# EAGLE design ECG (EAGLE 8.2.1)
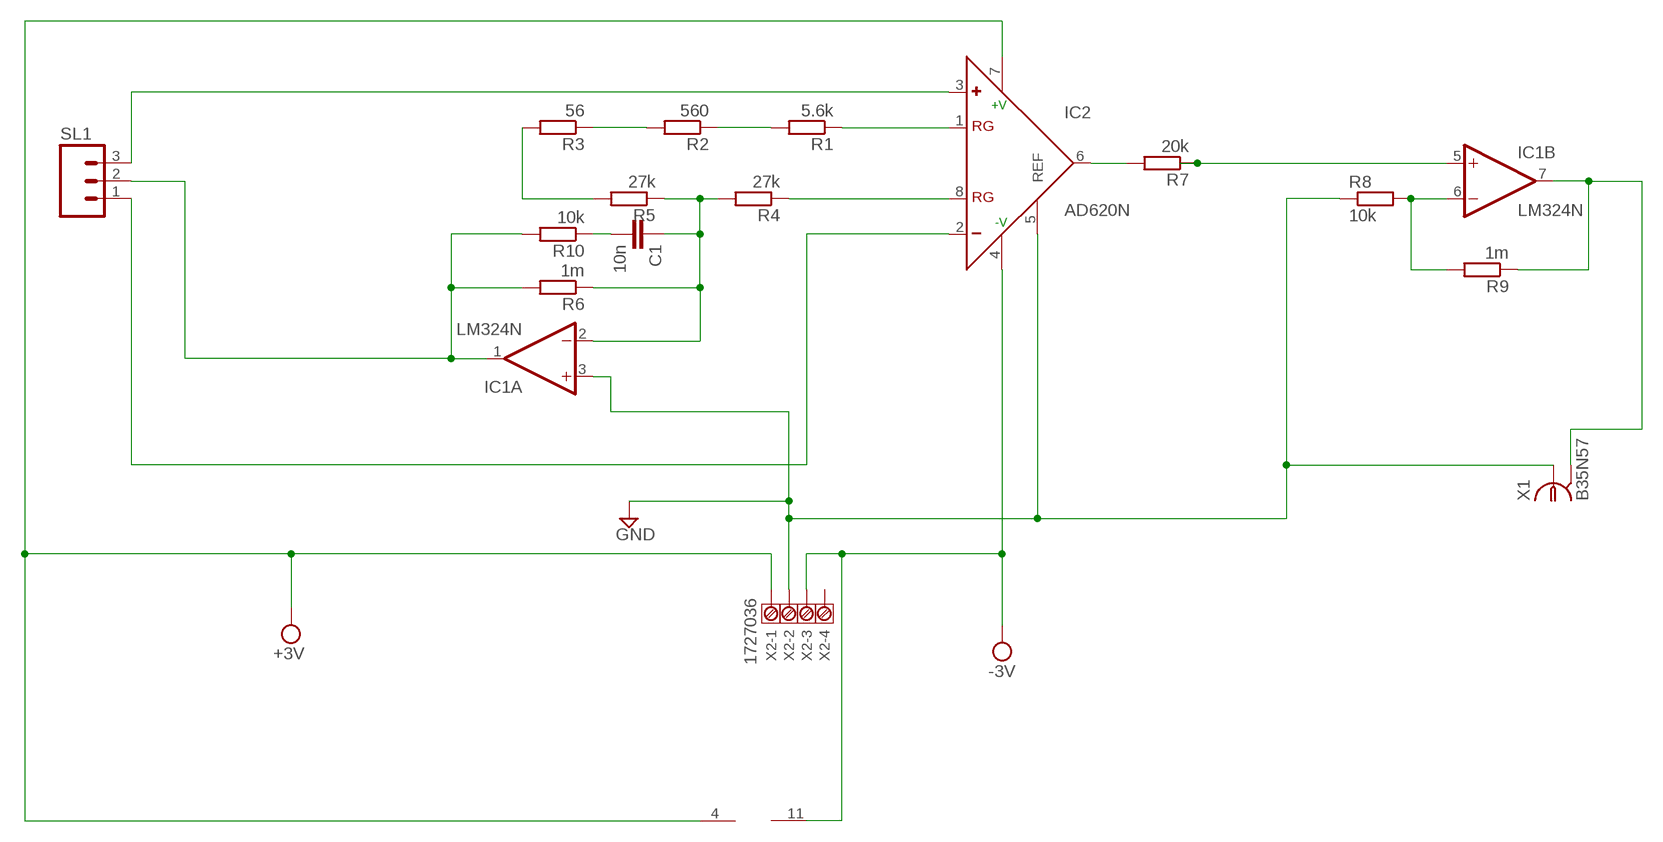
[diagram p0: schematic, sheet 1]

## Parts
C1  10n  C-EU025-024X044  [C025-024X044]
IC1  LM324N  [DIL14]
IC2  AD620N  [DIL08]
R1  5.6k  R-EU_0204/7  [0204/7]
R2  560  R-EU_0204/7  [0204/7]
R3  56  R-EU_0204/7  [0204/7]
R4  27k  R-EU_0204/7  [0204/7]
R5  27k  R-EU_0204/7  [0204/7]
R6  1m  R-EU_0204/7  [0204/7]
R7  20k  R-EU_0204/7  [0204/7]
R8  10k  R-EU_0204/7  [0204/7]
R9  1m  R-EU_0204/7  [0204/7]
R10  10k  R-EU_0204/7  [0204/7]
SL1  MA03  [03P]
X1  B35N57  [B35N57]
X2  1727036  [1727036]

## Nets
GND: IC1.3(A:+IN) IC2.5(REF) R8.1 X1.1 X2.2
N$1: IC1.5(B:+IN) R7.1
N$2: R1.2 R2.1
N$3: IC2.8(RG) R4.1
N$4: IC2.1(RG) R1.1
N$5: IC2.6(OUT) R7.2
N$6: IC1.1(A:OUT) R6.2 R10.2 SL1.2
N$7: R2.2 R3.1
N$8: R3.2 R5.2
N$10: IC2.2(-) SL1.1
N$11: IC2.3(+) SL1.3
N$13: C1.2 R10.1
N$14: C1.1 IC1.2(A:-IN) R4.2 R5.1 R6.1
N$16: IC1.6(B:-IN) R8.2 R9.2
N$17: IC1.7(B:OUT) R9.1 X1.2 X1.3 X1.4 X1.5
VCC: IC1.4(P:V+) IC2.7(+V) X2.1 ; supply symbol labelled +3V
VEE: IC1.11(P:V-) IC2.4(-V) X2.3 ; supply symbol labelled -3V
Unconnected: IC1.8(C:OUT) IC1.9(C:-IN) IC1.10(C:+IN) IC1.12(D:+IN) IC1.13(D:-IN) IC1.14(D:OUT) X2.4

## Library data of the parts
C1 = rcl:C-EU: CAPACITOR, European symbol
IC1 = linear:LM324: OP AMP
IC2 = analog-devices:AD620: Low Cost, Low Power, Instrumentation Amplifier Source: http://www.analog.com/UploadedFiles/Data_Sheets/37793330023930AD620_e.pdf; MF: ALTERA CORPORATION; MPN: AD620AN; OC_FARNELL: 1523782; OC_NEWARK: 05F7108
R1-R10 = rcl:R-EU_: RESISTOR, European symbol
SL1 = con-amp-quick:MA03: AMP QUICK CONNECTOR; OC_FARNELL: unknown; OC_NEWARK: unknown
X1 = con-coax:B35N57: BNC CONNECTOR M/A COM www.macom.com; OC_FARNELL: unknown; OC_NEWARK: unknown
X2 = con-phoenix-3.81:1727036: MKDS 1/4-3,81 Source: http://eshop.phoenixcontact.de; MF: FARNELL; MPN: 1727036; OC_FARNELL: 3704592; OC_NEWARK: 71C4114

## Board
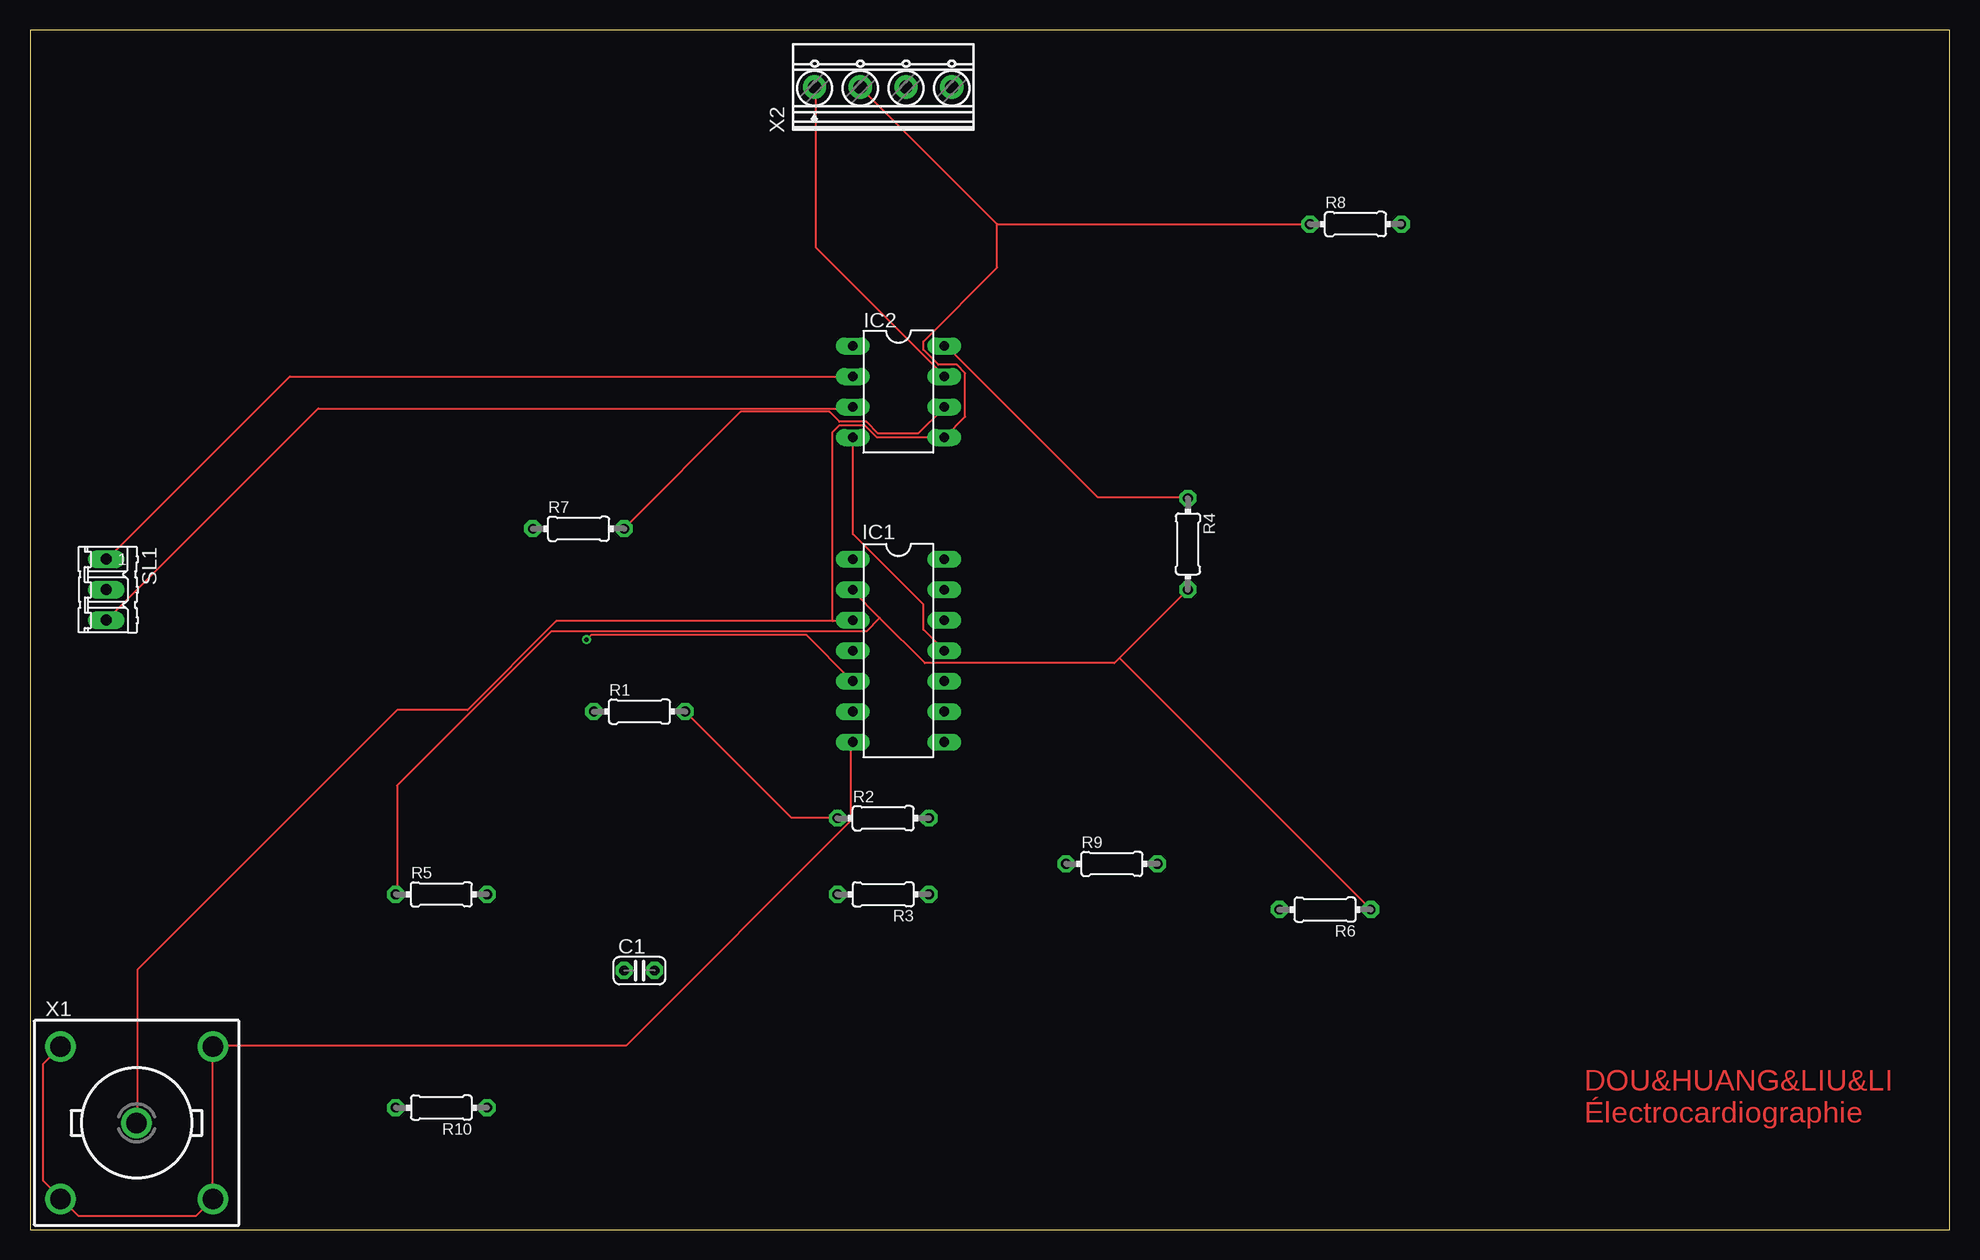
[diagram p1: board, top side]
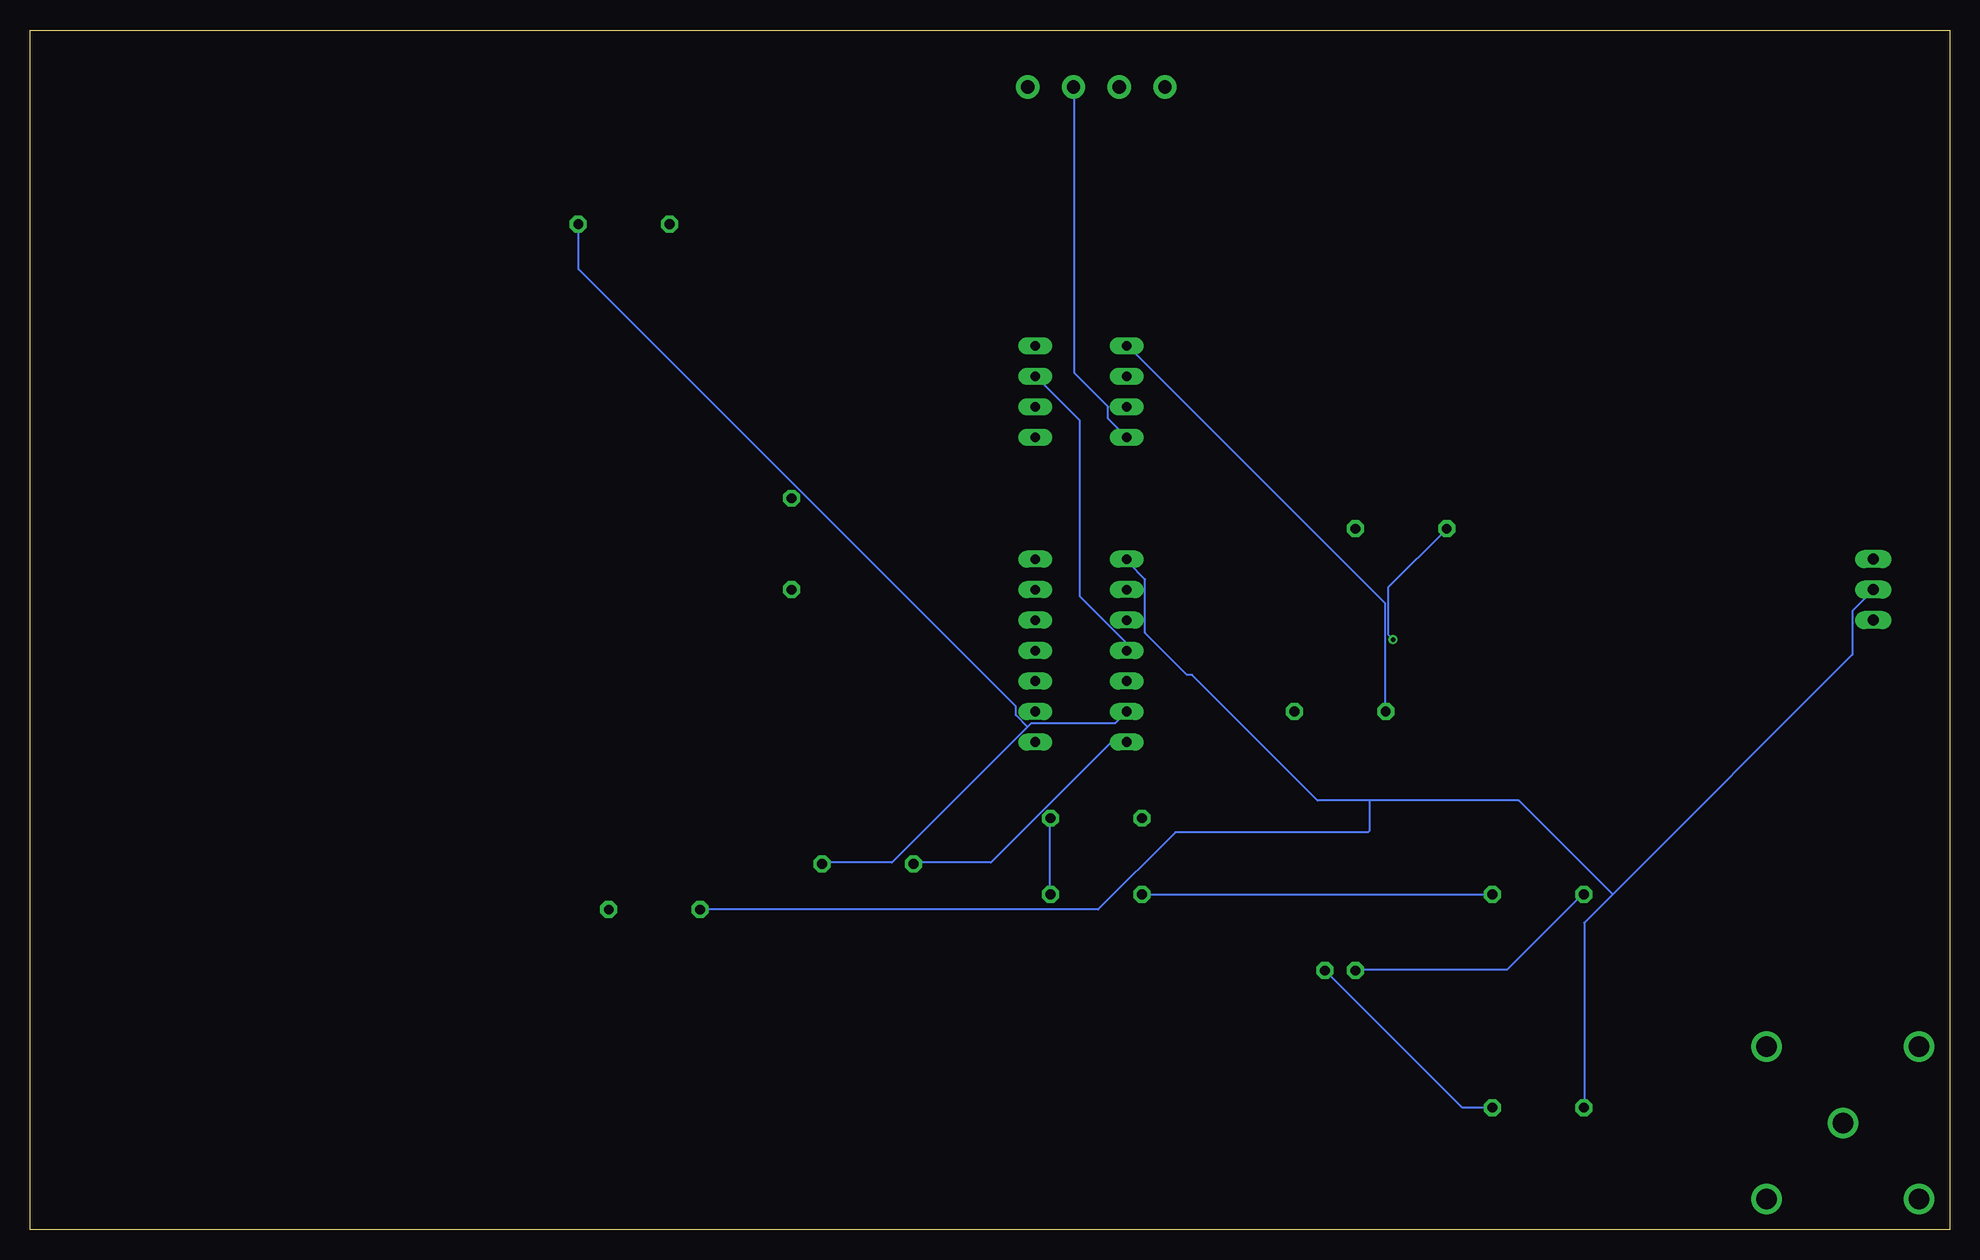
[diagram p2: board, bottom side, seen from below]

Size 160 x 100 mm. Coordinates in mm from the lower left corner, seen from the top.
Outline: 0,0 160,0 160,100 0,100 0,0
Copper layers (1*16): Top 0.035mm / dielectric 1.5mm / Bottom 0.035mm
Design rules "default": minimum track width 6mil, minimum drill 0.35mm, track to track 5mil, track to pad 5mil, pad to pad 5mil, via to via 5mil, smd to smd 5mil, copper to edge 40mil, drill to drill 6mil, minimum pad ring 0.3mm, minimum via ring 8mil, stop-mask expansion 4mil, vias tented up to drill 0mil, thermal gap 10mil

### Footprints (pad centres in the part's own frame; a part is rotated, then mirrored left to right if it is on the bottom)
C025-024X044 = drill 0.813 octagon: 1 -1.27,0; 2 1.27,0
DIL14 = drill 0.813 long: 1 -7.62,-3.81; 2 -5.08,-3.81; 3 -2.54,-3.81; 4 0,-3.81; 5 2.54,-3.81; 6 5.08,-3.81; 7 7.62,-3.81; 8 7.62,3.81; 9 5.08,3.81; 10 2.54,3.81; 11 0,3.81; 12 -2.54,3.81; 13 -5.08,3.81; 14 -7.62,3.81
DIL08 = drill 0.813 long: 1 -3.81,-3.81; 2 -1.27,-3.81; 3 1.27,-3.81; 4 3.81,-3.81; 5 3.81,3.81; 6 1.27,3.81; 7 -1.27,3.81; 8 -3.81,3.81
0204/7 = drill 0.813 octagon: 1 -3.81,0; 2 3.81,0
03P = drill 0.914 long: 1 -2.54,0; 2 0,0; 3 2.54,0
B35N57 = drill 1.7: 1 0,0; 2 6.35,6.35; 3 -6.35,6.35; 4 -6.35,-6.35; 5 6.35,-6.35
1727036 = drill 1.1 pad 1.93: 1 -5.715,0; 2 -1.905,0; 3 1.905,0; 4 5.715,0

### Placement (x,y rotation side)
C1  50.8,21.59 0 top
IC1  72.39,48.26 270 top
IC2  72.39,69.85 270 top
R1  50.8,43.18 0 top
R2  71.12,34.29 0 top
R3  71.12,27.94 180 top
R4  96.52,57.15 270 top
R5  34.29,27.94 0 top
R6  107.95,26.67 180 top
R7  45.72,58.42 0 top
R8  110.49,83.82 0 top
R9  90.17,30.48 0 top
R10  34.29,10.16 180 top
SL1  6.35,53.34 270 top
X1  8.89,8.89 0 top
X2  71.12,95.25 0 top

### Tracks (layer width: path | path; a pad name or v marks a point on that pad's centre or on a via)
GND
  Top 0.152: 80.61,83.82 R8.1 | 80.61,83.82 69.29,95.14 X2.2 | 66.92,50.71 68.45,50.71 IC1.3 | 66.92,50.71 43.87,50.71 36.46,43.31 30.59,43.31 8.94,21.65 8.94,8.94 X1.1 | 66.92,50.71 66.92,66.5 67.47,67.06 69.57,67.06 70.55,66.08 76.14,66.08 IC2.5 76.28,66.08 77.95,67.75 77.95,71.39 77.25,72.08 75.72,72.08 74.46,73.34 74.46,74.04 80.61,80.19 80.61,83.82
N$1  (via drill 0.35)
  Top 0.152: v46.38,49.17 46.8,49.59 64.68,49.59 68.45,45.82 IC1.5
  Bottom 0.152: v46.38,49.17 46.8,49.59 46.8,53.51 41.91,58.4 R7.1
N$2
  Top 0.152: R1.2 63.42,34.37 67.2,34.37 R2.1
N$3
  Top 0.152: R4.1 96.39,61.05 88.99,61.05 76.28,73.76 IC2.8
N$4
  Bottom 0.152: R1.1 47.08,43.31 47.08,52.25 68.45,73.62 IC2.1
N$5
  Top 0.152: R7.2 49.59,58.53 59.23,68.17 66.64,68.17 67.47,67.33 69.71,67.33 70.69,66.36 74.04,66.36 76.14,68.45 IC2.6
N$6
  Bottom 0.152: 28.08,27.94 8.1,47.92 8.1,51.55 6.43,53.23 SL1.2 | 28.08,27.94 30.45,25.57 30.45,10.2 R10.2 | 48.34,35.76 35.9,35.76 28.08,27.94 | 48.34,35.76 52.67,35.76 63.14,46.24 63.56,46.24 67.06,49.73 67.06,54.2 68.45,55.6 68.45,55.88 IC1.1 | 48.34,35.76 48.34,33.25 48.48,33.11 64.54,33.11 70.97,26.68 104.08,26.68 R6.2
N$7
  Bottom 0.152: R3.1 75.02,27.94 75.02,34.23 R2.2
N$8
  Bottom 0.152: R3.2 R5.2
N$10
  Top 0.152: IC2.2 68.45,71.11 21.65,71.11 6.43,55.88 SL1.1
N$11
  Top 0.152: IC2.3 68.45,68.45 24.03,68.45 6.43,50.85 SL1.3
N$13
  Bottom 0.152: R10.1 38.14,10.2 40.65,10.2 51.97,21.51 C1.2
N$14
  Top 0.152: 70.83,50.99 74.6,47.22 90.39,47.22 90.81,47.64 | 70.83,50.99 68.59,53.23 IC1.2 | 90.81,47.64 96.39,53.23 R4.2 | 90.81,47.64 111.76,26.68 R6.1 | 70.83,50.99 69.71,49.87 43.45,49.87 30.59,37.02 30.59,27.94 R5.1
  Bottom 0.152: C1.1 49.45,21.65 36.88,21.65 30.59,27.94 R5.1
N$16
  Bottom 0.152: 76.83,41.91 76.56,42.19 69.57,42.19 IC1.6 | 76.83,41.91 88.15,30.59 93.88,30.59 R9.2 | 76.83,41.91 77.81,42.89 77.81,43.59 114.28,80.05 114.28,83.82 R8.2
N$17
  Top 0.152: X1.3 2.52,15.23 1.12,13.83 1.12,4.05 2.52,2.65 X1.4 2.65,2.52 4.05,1.12 13.83,1.12 15.23,2.52 X1.5 15.23,2.65 15.23,15.23 X1.2 15.37,15.37 49.73,15.37 68.45,34.09 68.45,40.51 IC1.7
  Bottom 0.152: R9.1 86.33,30.59 79.91,30.59 69.99,40.51 68.59,40.51 IC1.7
VCC
  Top 0.152: X2.1 65.52,95.14 65.52,81.86 76.14,71.25 IC2.7
  Bottom 0.152: IC1.4 68.59,48.34 68.59,48.9 72.5,52.81 72.5,67.47 76.14,71.11 IC2.7
VEE
  Top 0.152: IC2.4 68.59,65.94 68.59,57.98 74.46,52.11 74.46,50.01 76.14,48.34 IC1.11
  Bottom 0.152: X2.3 72.92,95.14 72.92,71.39 70.13,68.59 70.13,67.61 68.59,66.08 IC2.4

### Text on the board
Top: DOU&HUANG&LIU&LI / Électrocardiographie